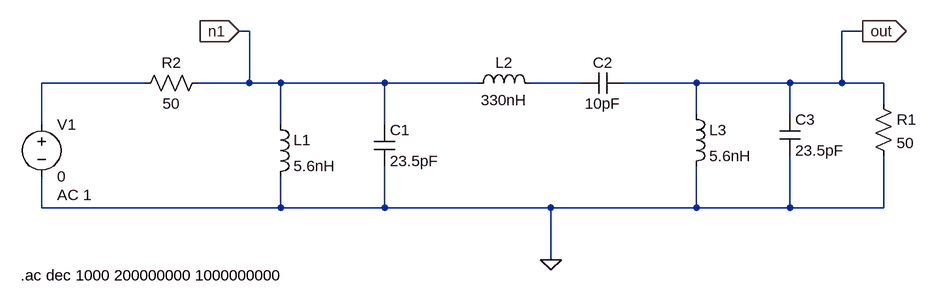
[diagram p0: schematic 437MHz_BPF_v03.asc]
437MHz_BPF_v03.asc, the LTspice schematic file:
Version 4.1
SHEET 1 1056 680
WIRE 16 16 0 16
WIRE 960 16 928 16
WIRE -144 96 -304 96
WIRE 16 96 16 16
WIRE 16 96 -64 96
WIRE 64 96 16 96
WIRE 224 96 64 96
WIRE 368 96 224 96
WIRE 528 96 448 96
WIRE 704 96 592 96
WIRE 848 96 704 96
WIRE 928 96 928 16
WIRE 928 96 848 96
WIRE 992 96 928 96
WIRE 992 128 992 96
WIRE 704 144 704 96
WIRE 848 144 848 96
WIRE -304 160 -304 96
WIRE 64 160 64 96
WIRE 224 160 224 96
WIRE -304 288 -304 240
WIRE 64 288 64 240
WIRE 64 288 -304 288
WIRE 224 288 224 224
WIRE 224 288 64 288
WIRE 480 288 224 288
WIRE 704 288 704 224
WIRE 704 288 480 288
WIRE 848 288 848 208
WIRE 848 288 704 288
WIRE 992 288 992 208
WIRE 992 288 848 288
WIRE 480 368 480 288
FLAG 480 368 0
FLAG 0 16 n1
IOPIN 0 16 In
FLAG 960 16 out
IOPIN 960 16 Out
SYMBOL voltage -304 144 R0
WINDOW 123 24 124 Left 2
WINDOW 39 0 0 Left 0
SYMATTR InstName V1
SYMATTR Value 0
SYMATTR Value2 AC 1
SYMBOL ind 48 144 R0
SYMATTR InstName L1
SYMATTR Value 5.6nH
SYMBOL cap 208 160 R0
SYMATTR InstName C1
SYMATTR Value 23.5pF
SYMBOL ind 352 112 R270
WINDOW 0 32 56 VTop 2
WINDOW 3 5 56 VBottom 2
SYMATTR InstName L2
SYMATTR Value 330nH
SYMBOL cap 592 80 R90
WINDOW 0 0 32 VBottom 2
WINDOW 3 32 32 VTop 2
SYMATTR InstName C2
SYMATTR Value 10pF
SYMBOL ind 688 128 R0
SYMATTR InstName L3
SYMATTR Value 5.6nH
SYMBOL cap 832 144 R0
SYMATTR InstName C3
SYMATTR Value 23.5pF
SYMBOL res 976 112 R0
SYMATTR InstName R1
SYMATTR Value 50
SYMBOL res -48 80 R90
WINDOW 0 0 56 VBottom 2
WINDOW 3 32 56 VTop 2
SYMATTR InstName R2
SYMATTR Value 50
TEXT -336 392 Left 2 !.ac dec 1000 200000000 1000000000

The netlist it stands for:
* 437MHz_BPF_v03.asc
V1 N001 0 0 AC 1
L1 n1 0 5.6nH
C1 n1 0 23.5pF
L2 n1 N002 330nH
C2 out N002 10pF
L3 out 0 5.6nH
C3 out 0 23.5pF
R1 out 0 50
R2 n1 N001 50
.ac dec 1000 200000000 1000000000
.backanno
.end